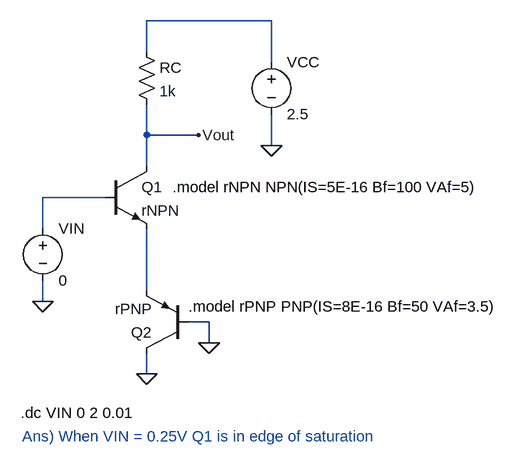
[diagram p0: schematic 4_60.asc]
4_60.asc, the LTspice schematic file:
Version 4
SHEET 1 880 680
WIRE 336 -96 144 -96
WIRE 144 -48 144 -96
WIRE 336 -32 336 -96
WIRE 144 80 144 32
WIRE 224 80 144 80
WIRE 336 96 336 48
WIRE 144 128 144 80
WIRE 80 176 -16 176
WIRE -16 224 -16 176
WIRE 144 320 144 224
WIRE -16 336 -16 304
WIRE 240 368 208 368
WIRE 240 400 240 368
WIRE 144 448 144 416
FLAG -16 336 0
FLAG 336 96 0
FLAG 224 80 Vout
FLAG 144 448 0
FLAG 240 400 0
SYMBOL npn 80 128 R0
SYMATTR InstName Q1
SYMATTR Value rNPN
SYMBOL voltage -16 208 R0
SYMATTR InstName VIN
SYMATTR Value 0
SYMBOL voltage 336 -48 R0
SYMATTR InstName VCC
SYMATTR Value 2.5
SYMBOL res 128 -64 R0
SYMATTR InstName RC
SYMATTR Value 1k
SYMBOL pnp 208 416 R180
SYMATTR InstName Q2
SYMATTR Value rPNP
TEXT 184 160 Left 2 !.model rNPN NPN(IS=5E-16 Bf=100 VAf=5)
TEXT -48 544 Left 2 ;Ans) When VIN = 0.25V Q1 is in edge of saturation
TEXT 208 344 Left 2 !.model rPNP PNP(IS=8E-16 Bf=50 VAf=3.5)
TEXT -50 508 Left 2 !.dc VIN 0 2 0.01

The netlist it stands for:
* 4_60.asc
Q1 Vout N002 N003 0 rNPN
VIN N002 0 0
VCC N001 0 2.5
RC N001 Vout 1k
Q2 0 0 N003 0 rPNP
.model NPN NPN
.model PNP PNP
.lib standard.bjt
.model rNPN NPN(IS=5E-16 Bf=100 VAf=5)
* Ans) When VIN = 0.25V Q1 is in edge of saturation
.model rPNP PNP(IS=8E-16 Bf=50 VAf=3.5)
.dc VIN 0 2 0.01
.backanno
.end

* Results of the author's LTspice run, read from the files saved beside the schematic
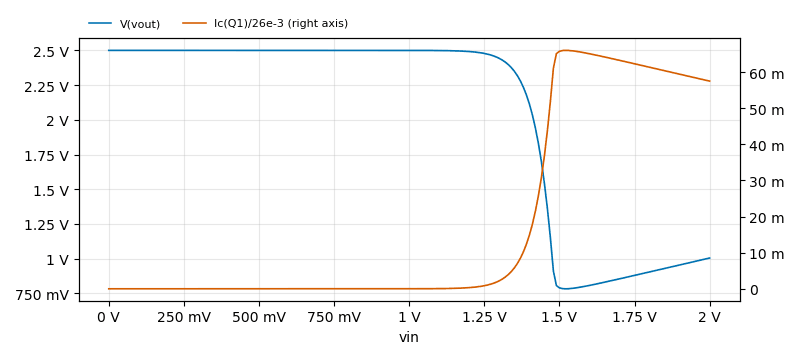
[diagram p1: DC transfer characteristic of 4_60.asc, plotted from the saved traces]
* DC transfer characteristic, 1 run:
*   V(vout): 2.5 V at vin=0 V, 1.004 V at vin=2 V, min 782.9 mV, max 2.5 V
*   Ic(Q1)/26e-3: 96.2 p at vin=0 V, 57.52 m at vin=2 V, min 89.74 p, max 66.04 m